# Altium project Master.PrjPcb
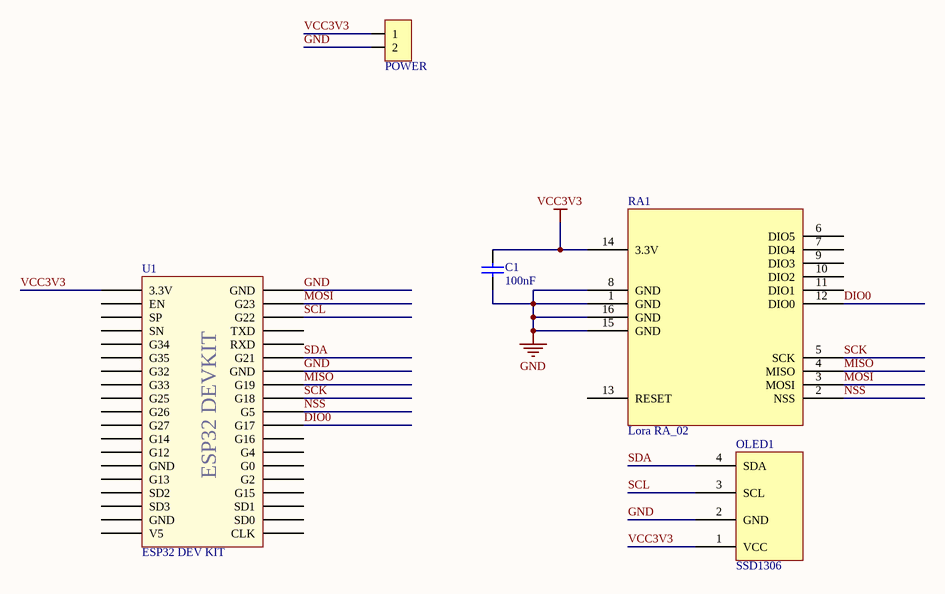
[diagram p0: Master.SchDoc]
1 sheet, 5 parts. Net scope: global (net labels, ports and power ports of the same name join across sheets).
Board file: Master1.PcbDoc

## Sheet Master.SchDoc
size A; SheetNumber: 1; SheetTotal: 1

### Parts
C1  100nF  [tu 0603]
JP2  POWER  [JP 1x2 CT]
OLED1  SSD1306  [SSD1306]
RA1  Lora RA_02  [SOP16]
U1  ESP32 DEV KIT  [ESP32 DEVKIT]

### Nets
GND: C1.2 JP2.2 OLED1.2(GND) RA1.1(GND) RA1.8(GND) RA1.15(GND) RA1.16(GND) U1.32(GND) U1.38(GND)
VCC3V3: C1.1 JP2.1 OLED1.1(VCC) RA1.14(3.3V) U1.1(3.3V)
DIO0: RA1.12(DIO0) U1.28(G17)
MISO: RA1.4(MISO) U1.31(G19)
MOSI: RA1.3(MOSI) U1.37(G23)
NSS: RA1.2(NSS) U1.29(G5)
SCK: RA1.5(SCK) U1.30(G18)
SCL: OLED1.3(SCL) U1.36(G22)
SDA: OLED1.4(SDA) U1.33(G21)

Not connected (* = marked no-connect by the designer): RA1 6(DIO5) 7(DIO4) 9(DIO3) 10(DIO2) 11(DIO1) 13(RESET); U1 2(EN) 3(SP) 4(SN) 5(G34) 6(G35) 7(G32) 8(G33) 9(G25) 10(G26) 11(G27) 12(G14) 13(G12) 14(GND) 15(G13) 16(SD2) 17(SD3) 18(GND) 19(V5) 20(CLK) 21(SD0) 22(SD1) 23(G15) 24(G2) 25(G0) 26(G4) 27(G16) 34(RXD) 35(TXD)

### Notes on the sheet
- (in symbol ESP32 DEV KIT) ESP32 DEVKIT

### Library data of the parts
C1 = Tu 0603 104 50V 10%: Dán; Don_Vi: Con; So_Chan: 2; Ten_Linh_Kien: Tụ 0603 104-100nF 10% 50V; Ma_Hang: MH004568; Chung_Loai: Dán; Kieu_Chan: *
JP2 = JP 1x2 2.54 Cai Thang: Cắm; Ten_Linh_Kien: Jump Đơn Cái 2.54MM 1x20P Thẳng; Don_Vi: Con; Ma_Hang: MH004006; Ghi_Chu: *; Kieu_Chan: *; Chung_Loai: Cắm